# EAGLE design Adafruit FONA 800 Shield (EAGLE 6.6.0)
COMPANY: ADAFRUIT INDUSTRIES; DRAWN: KTOWN; REV: B
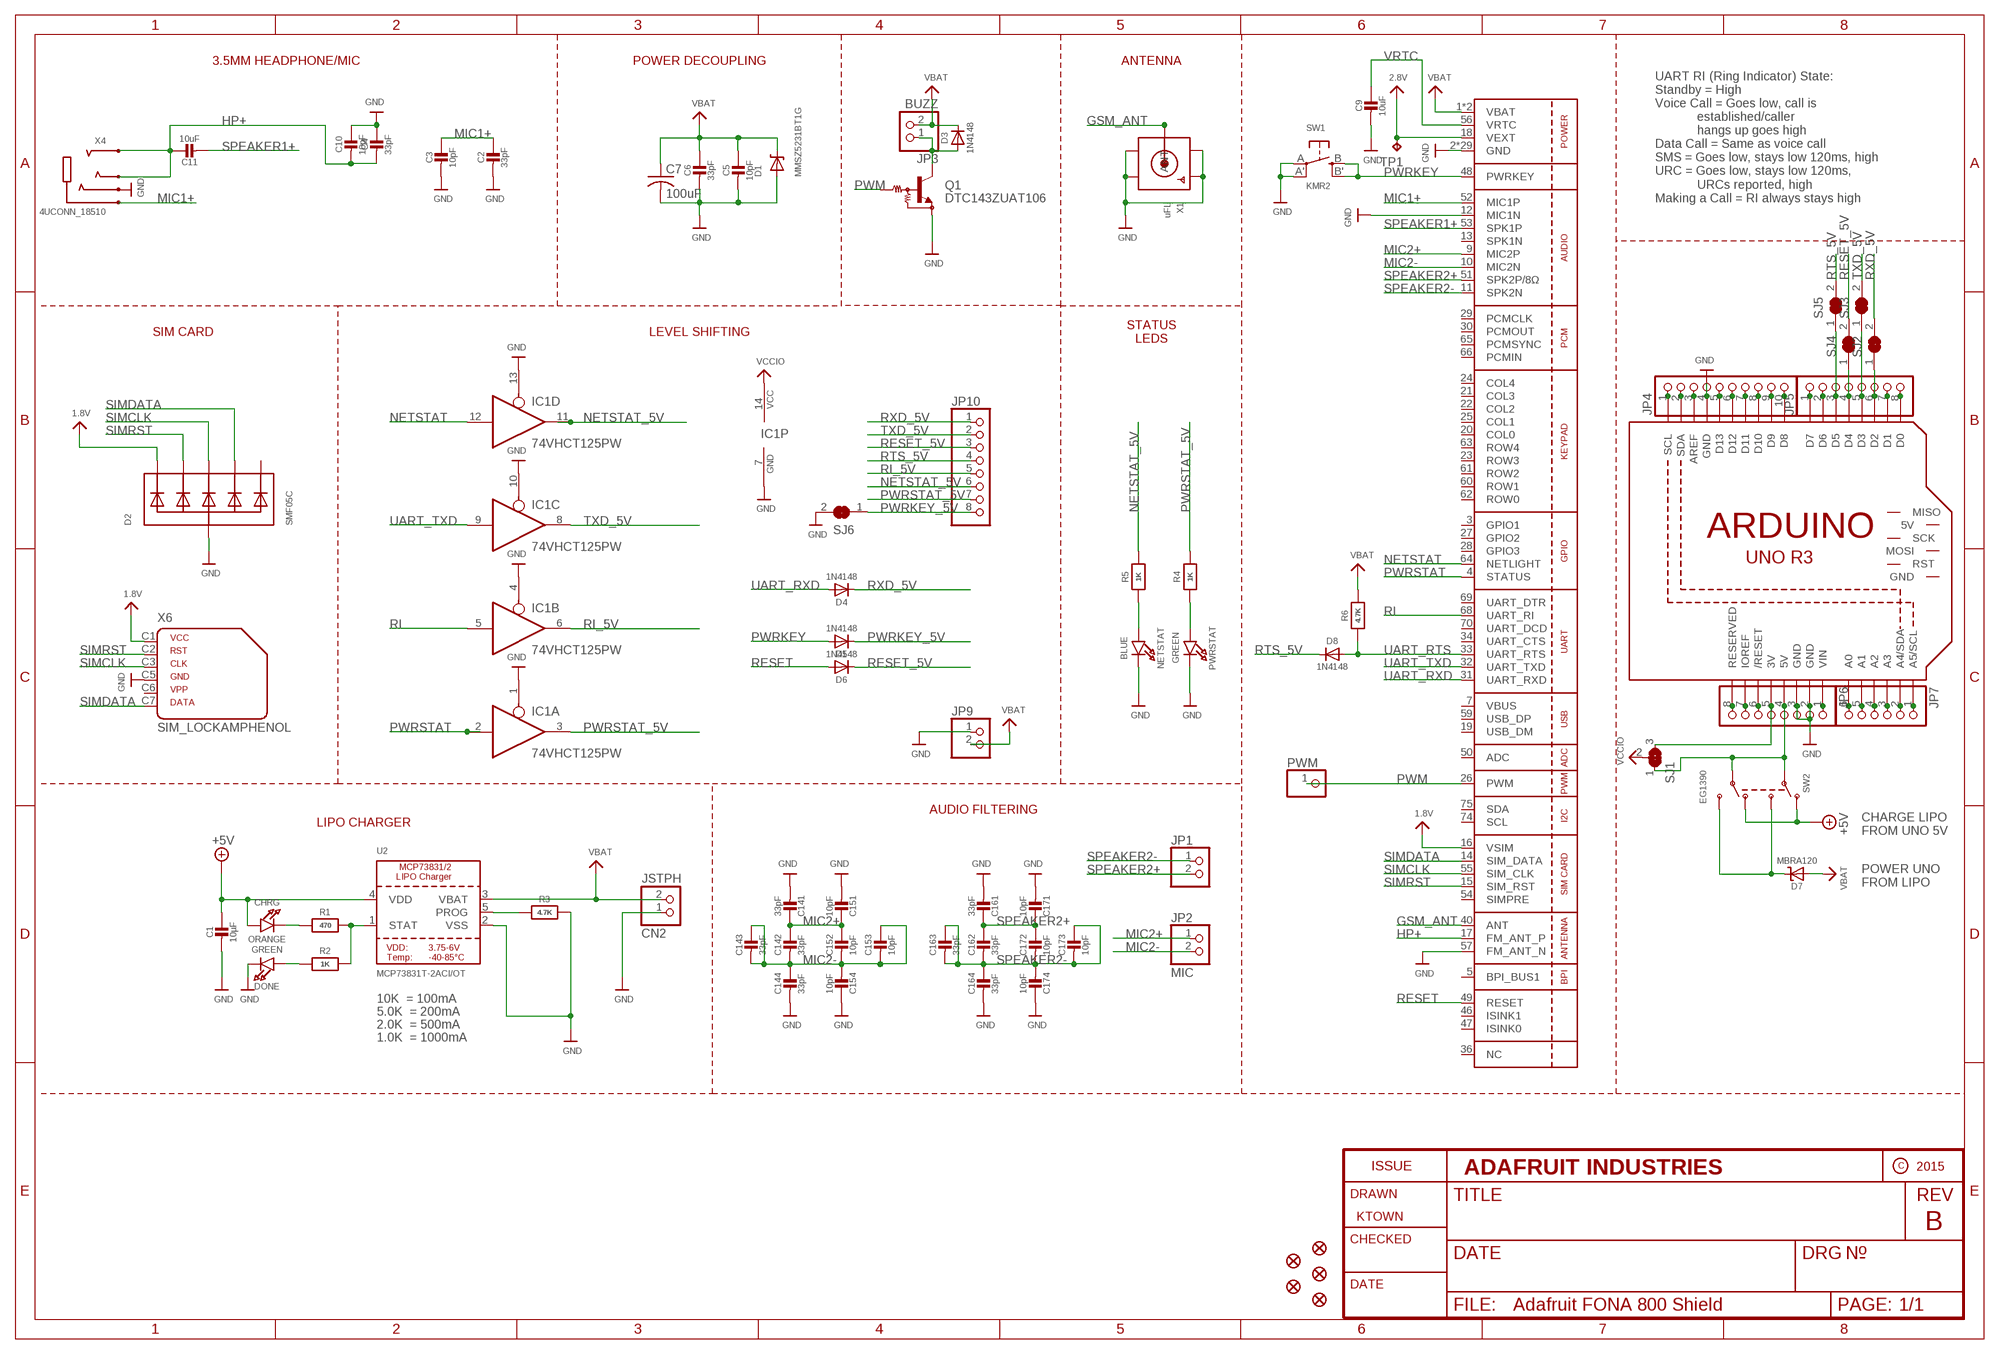
[diagram p0: schematic, sheet 1]

## Parts
C1  10µF  CAP_CERAMIC0805-NOOUTLINE  [0805-NO]
C2  33pF  CAP_CERAMIC0805-NOOUTLINE  [0805-NO]
C3  10pF  CAP_CERAMIC0805-NOOUTLINE  [0805-NO]
C4  33pF  CAP_CERAMIC0805-NOOUTLINE  [0805-NO]
C5  10pF  CAP_CERAMIC0805-NOOUTLINE  [0805-NO]
C6  33pF  CAP_CERAMIC0805-NOOUTLINE  [0805-NO]
C7  100uF  C-USC1210  [C1210]
C9  10uF  CAP_CERAMIC0805-NOOUTLINE  [0805-NO]
C10  10pF  CAP_CERAMIC0805-NOOUTLINE  [0805-NO]
C11  10uF  CAP_CERAMIC0805-NOOUTLINE  [0805-NO]
C14  33pF  CAP_4PACK1206  [RESPACK_4X0603]
C15  10pF  CAP_4PACK1206  [RESPACK_4X0603]
C16  33pF  CAP_4PACK1206  [RESPACK_4X0603]
C17  10pF  CAP_4PACK1206  [RESPACK_4X0603]
CHRG  ORANGE  LED0805_NOOUTLINE  [CHIPLED_0805_NOOUTLINE]
CN2  JSTPH  CON_JST_PH_2PIN  [JSTPH2]
D1  MMSZ5231BT1G  DIODE-ZENERSOD123  [SOD-123]
D2  SMF05C  TVSARRAY_5LANE  [SOT363]
D3  1N4148  DIODESOD-323  [SOD-323]
D4  1N4148  DIODESOD-323  [SOD-323]
D5  1N4148  DIODESOD-323  [SOD-323]
D6  1N4148  DIODESOD-323  [SOD-323]
D7  MBRA120  DIODE-SCHOTTKYSOD-123  [SOD-123]
D8  1N4148  DIODESOD-323  [SOD-323]
DONE  GREEN  LED0805_NOOUTLINE  [CHIPLED_0805_NOOUTLINE]
FID1  FIDUCIAL""  [FIDUCIAL_1MM]
FID2  FIDUCIAL""  [FIDUCIAL_1MM]
FID3  FIDUCIAL""  [FIDUCIAL_1MM]
FID4  FIDUCIAL""  [FIDUCIAL_1MM]
FID5  FIDUCIAL""  [FIDUCIAL_1MM]
IC1  74VHCT125PW  74ABT125PW  [TSSOP14]
JP1  HEADER-1X2ROUND  [1X02_ROUND]
JP2  MIC  HEADER-1X2ROUND  [1X02_ROUND]
JP3  BUZZ  HEADER-1X2ROUND  [1X02_ROUND]
JP4  HEADER-1X1070MIL  [1X10_ROUND70]
JP5  HEADER-1X876MIL  [1X08_ROUND_76]
JP6  HEADER-1X876MIL  [1X08_ROUND_76]
JP7  HEADER-1X676MIL  [1X06_ROUND_76]
JP9  HEADER-1X2ROUND  [1X02_ROUND]
JP10  HEADER-1X876MIL  [1X08_ROUND_76]
M1  ARDUINO_R3_ICSP_NODIM  [ARDUINOR3_ICSP_NODIM]
NETSTAT  BLUE  LED0805_NOOUTLINE  [CHIPLED_0805_NOOUTLINE]
PWM  PINHD-1X1CB  [1X01-CLEANBIG]
PWRSTAT  GREEN  LED0805_NOOUTLINE  [CHIPLED_0805_NOOUTLINE]
Q1  DTC143ZUAT106  MUN2211T1-NPN_DRIVER-SC59-BEC  [SC59-BEC]
R1  470  RESISTOR0805_NOOUTLINE  [0805-NO]
R2  1K  RESISTOR0805_NOOUTLINE  [0805-NO]
R3  4.7K  RESISTOR0805_NOOUTLINE  [0805-NO]
R4  1K  RESISTOR0805_NOOUTLINE  [0805-NO]
R5  1K  RESISTOR0805_NOOUTLINE  [0805-NO]
R6  4.7K  RESISTOR0805_NOOUTLINE  [0805-NO]
SJ1  SOLDERJUMPER_2WAY  [SOLDERJUMPER_2WAY_OPEN_NOPASTE]
SJ2  SOLDERJUMPER_CLOSED  [SOLDERJUMPER_CLOSEDWIRE]
SJ3  SOLDERJUMPER_CLOSED  [SOLDERJUMPER_CLOSEDWIRE]
SJ4  SOLDERJUMPER_CLOSED  [SOLDERJUMPER_CLOSEDWIRE]
SJ5  SOLDERJUMPER_CLOSED  [SOLDERJUMPER_CLOSEDWIRE]
SJ6  SOLDERJUMPER_CLOSED  [SOLDERJUMPER_CLOSEDWIRE]
SW1  KMR2  SWITCH_TACT_SMT  [EVQ-Q2]
SW2  EG1390  SWITCH_DPDTEG1390  [EG1390]
TP1  TPTP11R  [TP11R]
U1  SIM800H/L  GSM_SIM800L  [SIM800L]
U2  MCP73831T-2ACI/OT  MCP73831/2  [SOT23-5]
X1  uFL  SMACONNECTOR_EDGE_UFL  [SMA_EDGELAUNCH_UFL]
X4  4UCONN_18510  AUDIO_3.5MMJACK_4POL  [4UCONN_18510]
X6  SIM_LOCKAMPHENOL  [C707_10M006_512_2]

## Nets
1.8V: D2.1(C1) U1.16(VSIM) X6.C1
2.8V: TP1.TP U1.18(VEXT)
3V: JP6.5 M1.3V SJ1.3
5V: JP6.4 M1.5V SJ1.1 SW2.P1 SW2.P2
+5V: C1.1 CHRG.A SW2.O1 SW2.O2 U2.4(VDD)
A0: JP7.6 M1.A0
A1: JP7.5 M1.A1
A2: JP7.4 M1.A2
A3: JP7.3 M1.A3
A4: JP7.2 M1.A4(A4/SDA)
A5: JP7.1 M1.A5(A5/SCL)
AREF: JP4.3 M1.AREF
BUZZ-: D3.A JP3.1 Q1.C
D0: JP5.8 M1.D0
D1: JP5.7 M1.D1
D2: JP5.6 M1.D2 SJ2.1
D3: JP5.5 M1.D3 SJ3.1
D4: JP5.4 M1.D4 SJ4.1
D5: JP5.3 M1.D5 SJ5.1
D6: JP5.2 M1.D6
D7: JP5.1 M1.D7
D8: JP4.10 M1.D8
D9: JP4.9 M1.D9
D10: JP4.8 M1.D10
D11: JP4.7 M1.D11
D12: JP4.6 M1.D12
D13: JP4.5 M1.D13
GND: C1.2 C2.2 C3.2 C4.1 C5.2 C6.2 C7.2 C9.2 C10.1 C14.5 C14.8 C15.4 C15.8 C16.5 C16.8 C17.4 C17.8 CN2.1 D1.A D2.2(A) DONE.C IC1.1(A:OE) IC1.4(B:OE) IC1.7(P:GND) IC1.10(C:OE) IC1.13(D:OE) JP4.4 JP6.2 JP6.3 JP9.1 M1.GND M1.GND@1(GND) M1.GND@3(GND) NETSTAT.C PWRSTAT.C Q1.E R3.2 SJ6.2 SW1.A'(P1) SW1.A(P) U1.2(GND) U1.6(GND) U1.8(GND) U1.12(MIC1N) U1.35(GND) U1.37(GND) U1.38(GND) U1.39(GND) U1.41(GND) U1.43(GND) U1.44(GND) U1.45(GND) U1.57(FM_ANT_N) U1.58(GND) U1.67(GND) U1.71(GND) U1.72(GND) U1.73(GND) U1.76(GND) U1.77(GND) U1.78(GND) U1.79(GND) U1.80(GND) U1.81(GND) U1.82(GND) U1.83(GND) U1.84(GND) U1.85(GND) U1.86(GND) U1.87(GND) U1.88(GND) U2.2(VSS) X1.GND@1(GND1) X1.GND@2(GND2) X1.GND@3(GND3) X1.GND@4(GND4) X4.4-INNER_SLEEVE(RING1) X6.C5
GSM_ANT: U1.40(ANT) X1.P(ANT)
HP+: C4.2 C10.2 C11.1 U1.17(FM_ANT_P) X4.2-TIP(RING3) X4.3-OUTER_SLEEVE(RING2)
IOREF: JP6.7 M1.IOREF
MIC1+: C2.1 C3.1 U1.52(MIC1P) X4.1-GND(TIP)
MIC2+: C14.1 C14.2 C15.1 C15.2 JP2.1 U1.9(MIC2P)
MIC2-: C14.3 C14.4 C14.6 C14.7 C15.3 C15.5 C15.6 C15.7 JP2.2 U1.10(MIC2N)
N$1: CHRG.C R1.1
N$2: R1.2 R2.2 U2.1(STAT)
N$4: PWRSTAT.A R4.1
N$5: R3.1 U2.5(PROG)
N$6: DONE.A R2.1
N$7: D7.C SW2.S1 SW2.S2
N$9: NETSTAT.A R5.1
NC: JP6.8 M1.RESERVED
NETSTAT: IC1.12(D:I) U1.64(NETLIGHT)
NETSTAT_5V: IC1.11(D:O) JP10.6 R5.2
PWM: PWM.1 Q1.B U1.26(PWM)
PWRKEY: D5.A SW1.B'(S1) SW1.B(S) U1.48(PWRKEY)
PWRKEY_5V: D5.C JP10.8 SJ6.1
PWRSTAT: IC1.2(A:I) U1.4(STATUS)
PWRSTAT_5V: IC1.3(A:O) JP10.7 R4.2
RESET: D6.A U1.49(RESET)
RESET_5V: D6.C JP10.3 SJ4.2
RI: IC1.5(B:I) U1.68(UART_RI)
RI_5V: IC1.6(B:O) JP10.5
RST: JP6.6 M1.RESET(/RESET)
RTS_5V: D8.C JP10.4 SJ5.2
RXD_5V: D4.C JP10.1 SJ2.2
SCL: JP4.1 M1.SCL
SDA: JP4.2 M1.SDA
SIMCLK: D2.4(C3) U1.55(SIM_CLK) X6.C3
SIMDATA: D2.5(C4) U1.14(SIM_DATA) X6.C7
SIMRST: D2.3(C2) U1.15(SIM_RST) X6.C2
SPEAKER1+: C11.2 U1.53(SPK1P)
SPEAKER2+: C16.1 C16.2 C17.1 C17.2 JP1.2 U1.51(SPK2P/8Ω)
SPEAKER2-: C16.3 C16.4 C16.6 C16.7 C17.3 C17.5 C17.6 C17.7 JP1.1 U1.11(SPK2N)
TXD_5V: IC1.8(C:O) JP10.2 SJ3.2
UART_RTS: D8.A R6.1 U1.33(UART_RTS)
UART_RXD: D4.A U1.31(UART_RXD)
UART_TXD: IC1.9(C:I) U1.32(UART_TXD)
VBAT: C5.1 C6.1 C7.1 CN2.2 D1.C D3.C D7.A JP3.2 JP9.2 R6.2 U1.1(VBAT) U1.42(VBAT) U2.3(VBAT)
VCCIO: IC1.14(P:VCC) SJ1.2
VIN: JP6.1 M1.VIN
VRTC: C9.1 U1.56(VRTC)
Unconnected: D2.6(C5) M1.5V_ICSP(5V) M1.GND@2(GND) M1.MISO M1.MOSI M1.RESET_ICSP(RST) M1.SCK U1.3(GPIO1) U1.5(BPI_BUS1) U1.13(SPK1N) U1.19(USB_DM) U1.20(COL0) U1.21(COL3) U1.22(COL2) U1.23(ROW3) U1.24(COL4) U1.25(COL1) U1.27(GPIO2) U1.28(GPIO3) U1.29(PCMCLK) U1.30(PCMOUT) U1.34(UART_CTS) U1.36(NC) U1.46(ISINK1) U1.47(ISINK0) U1.50(ADC) U1.54(SIMPRE) U1.59(USB_DP) U1.60(ROW1) U1.61(ROW2) U1.62(ROW0) U1.63(ROW4) U1.65(PCMSYNC) U1.66(PCMIN) U1.69(UART_DTR) U1.70(UART_DCD) U1.74(SCL) U1.75(SDA) X6.C6

## Notes on the sheet
- 3.5MM HEADPHONE/MIC | POWER DECOUPLING | ANTENNA
- UART RI (Ring Indicator) State:
  Standby = High
  Voice Call = Goes low, call is 
              established/caller 
              hangs up goes high
  Data Call = Same as voice call
  SMS = Goes low, stays low 120ms, high
  URC = Goes low, stays low 120ms,
              URCs reported, high
  Making a Call = RI always stays high
- SIM CARD | LEVEL SHIFTING
- STATUS
  LEDS
- AUDIO FILTERING
- LIPO CHARGER
- CHARGE LIPO
  FROM UNO 5V
- POWER UNO
  FROM LIPO
- 10K  = 100mA
- 5.0K  = 200mA
- 2.0K  = 500mA
- 1.0K  = 1000mA

## Power pins joined to a net without a drawn wire
VBUS: U1.7(VBUS)

## Library data of the parts
C1-C6 C9-C11 = microbuilder:CAP_CERAMIC: Ceramic Capacitors For new designs, use the packages preceded by an '_' character since they are more reliable: The following footprints should be used on most boards: _0402 - Standard footprint for regular board layouts _0603 - Standard footprint for regular board layouts _0805 - Standard footprint for regular board layouts _1206 - Standard footprint for regular board layouts For extremely tight-pitch boards where space is at a premium, the following 'micro-pitch' footprints can be used (smaller pads, no silkscreen outline, etc.): _0402MP - Micro-pitch footprint for very dense/compact boards _0603MP - Micro-pitch footprint for very dense/compact boards _0805MP - Micro-pitch footprint for very dense/compact boards _1206MP - Micro-pitch footprint for very dense/compact boards
C7 = rcl:C-US: CAPACITOR, American symbol
C14-C17 = microbuilder:CAP_4PACK
CHRG DONE NETSTAT PWRSTAT = microbuilder:LED: LED 0603 - 0603 Surface Mount Package 2mA: Green LED - Low Power (3.9mcd, 2ma, 1.7Vf) - Digikey: 475-2709-2-ND Orange LED - Low Power (9.8mcd, 2ma, 1.8Vf) - Digikey: 475-1194-2-ND Red LED - Low Power (5mcd, 2ma, 1.8Vf) - Digikey: 475-1195-2-ND Yellow LED - Low Power (7mcd, 2ma, 1.8Vf) - Digikey: 475-1196-2-ND 5mA: Blue LED - Low Power (17mcd, 5ma, 2.9Vf) - Digikey: LNJ937W8CRACT-ND 0805 - 0805 Surface Mount Package 2mA: Red LED (8.8mcd, 2mA, 1.8Vf, Clear) - Low Power [Digikey: 475-2510-1-ND] Green LED (5mcd, 2mA, 1.8Vf, Clear) - Low Power [Digikey: 475-2730-1-ND] Yellow LED (11.3mcd, 2mA, 1.8Vf, Clear) - Low Power [Digikey: 475-2555-1-ND] 20mA: Red LED (104mcd, 20mA, Diffused) - LS R976 [Digikey: 475-1278-6-ND] Red LED (12mcd, 20mA, 2.0Vf, Clear) - APT2012EC [Digikey: 754-1128-1-ND] Green LED (15mcd, 20mA, 2.2Vf, Clear) - APT2012GC [Digikey: 754-1131-1-ND] Orange LED (160mcd, 20mA, 2.1Vf, Clear) - APT2012SECK [Digikey: 754-1130-1-ND] 1206 - 1206 Surface Mount Package Green LED (26mcd, 20mA, Diffused) - LG N971 [Digikey: 475-1407-6-ND] Red LED (15mcd, 20mA, Diffused) - LH N974 [Digikey: 475-1416-6-ND] Cree - Cree High-Power Surface Mount LEDs XPEBWT-L1-0000-00D50 - White 111lm 350mA 2.9Vf 6200K 110° XTEAWT-00-0000-00000LEE3 - White 114lm 350mA 2.85Vf 5000K 115° Everlight - Everlight 45-21 Series Surface Mount LEDs 45-21/QK2C-B2832AC2CB2/2T - Warm White 2000mcd 20mA 3.25Vf 3050K 120° 45-21/LK2C-B38452C4CB2/2T - Nuetral White 2000mcd 20mA 3.25Vf 4150K 120° 45-21/LK2C-B50634C6CB2/2T - Cold White 2200mcd 20mA 3.25Vf 5650K 120° PLCC2 Reverse Mount LS T77K-J1L2-1-0-2-R18-Z - Red 11.25mcd 2mA 1.8Vf 630nm 120° LO T77K-L1M2-24-Z - Orange 19.6mcd 2mA 1.8Vf 606nm 120° LY T77K-K2M1-26-Z - Yellow 15.7mcd 2mA 1.8Vf 587nm 120°
CN2 = microbuilder:CON_JST_PH_2PIN: JST 2-Pin Right-Angle Connector PH-Series - 4UConnector: 17311 SH-Series - 4UConnector: 07278
D1 = microbuilder:DIODE-ZENER: Zener Diode SMA: 30V 1W Zener Diode, 1.2Vf - Digikey: SMAZ30-FDICT-ND
D2 = microbuilder:TVSARRAY_5LANE: Voltage Transient Suppressor Array SOT363 SMF05C - 100W 5V: Digikey - SMF05CT1GOSCT-ND
D3-D6 D8 = microbuilder:DIODE: Diode SMA Model Volts Amps Type Vf Ir Digikey # Notes SSA34-E3 40V 3A Schottky 480mV @ 3A 200uA @ 40V SSA34-E3/61TGITR-ND CDBA120-G 20V 1A Schottky 500mV @ 1A 500uA @ 20V 641-1014-6-ND REEL MBRA210 10V 2A Schottky 350mV @ 2A 700uA @ 10V MBRA210LT3 SOD-123 Model Volts Amps Type Vf Ir Order # Notes BAT54T1G 30V 200mA Schottky 800mV @ 200mA 2uA @ 25V BAT54T1GOSTR-ND B0530W 30V 500mA Schottky 430mV @ 500mA 130uA @ 30V B0530W-FDICT-ND REEL MBR120 20V 1A Schottky 340mV @ 1A MBR120VLSFT1GOSCT-ND SOD-323 Model Volts Amps Type Vf Ir Order # Notes PMEG2005EJ 20V 500mA Schottky 355mV @ 500mA 568-4110-1-ND ZLLS410 10V 570mA Schottky 380mV @ 570mA ZLLS410CT-ND 1N4148WS 75V 150mA Silicon/Simple 1V 1N4148WSFSCT-ND REEL SOD-523 Model Volts Amps Type Vf Ir Order # Notes BAT54XV2 30V 200mA Schottky 0.8V @ 100mA BAT54XV2CT-ND TB751S 30V 30mA Schottky RB751S-40TE61CT-ND SOT23-R/W (R = Solder Paste/Reflow Ovens, W = Hand-Soldering) Model Volts Amps Type Vf Ir Order # Notes BAT54FILM 40V 300mA Schottky 497-7162-1-ND POWERDI-5 Model Volts Amps Type Vf Ir Order # Notes PDS560 60V 5A Schottky 670mV @ 5A 150uA @ 60V PDS560DICT-ND
D7 = microbuilder:DIODE-SCHOTTKY
FID1-FID5 = microbuilder:FIDUCIAL: Fiducial Alignment Points Various fiducial points for machine vision alignment.; BOM: EXCLUDE
IC1 = 74xx-us:74*125: Quad bus BUFFER, 3-state
JP1-JP3 JP9 = microbuilder:HEADER-1X2: PIN HEADER
JP4 = microbuilder:HEADER-1X10: PIN HEADER
JP5 JP6 JP10 = microbuilder:HEADER-1X8: PIN HEADER
JP7 = microbuilder:HEADER-1X6: PIN HEADER
M1 = adafruit:ARDUINO_R3_ICSP
PWM = adafruit:PINHD-1X1: Pin header 1x1 for 0.1" spacing With round pins
Q1 = transistor:*-NPN_DRIVER-: NPN Bias Resistor Transistor
R1-R6 = microbuilder:RESISTOR: Resistors For new designs, use the packages preceded by an '_' character since they are more reliable: The following footprints should be used on most boards: _0402 - Standard footprint for regular board layouts _0603 - Standard footprint for regular board layouts _0805 - Standard footprint for regular board layouts _1206 - Standard footprint for regular board layouts For extremely tight-pitch boards where space is at a premium, the following 'micro-pitch' footprints can be used (smaller pads, no silkscreen outline, etc.): _0402MP - Micro-pitch footprint for very dense/compact boards _0603MP - Micro-pitch footprint for very dense/compact boards _0805MP - Micro-pitch footprint for very dense/compact boards _1206MP - Micro-pitch footprint for very dense/compact boards
SJ1 = microbuilder:SOLDERJUMPER_2WAY: 2-Way Solder Jumper
SJ2-SJ6 = microbuilder:SOLDERJUMPER_CLOSED: Solder Jumper - Closed These solder jumpers are closed by default CLOSEDWIRE - 10 mil trace between pads that can be cut and resoldered later CLOSEDPERM - 63 mil trace between pads for a permanent connection (used to 'bridge' two signals, a shameless hack for Eagle). Can double as a test point as well (no cream layer)
SW1 = microbuilder:SWITCH_TACT_SMT: SMT Tact Switches 6x6mm - Digikey: P12940SCT-ND KMR2 (4.6x2.8mm) - Digikey: 401-1426-1-ND EVQ-PQHB55 - Light Touch, 160GF (4.5x4.5mm) - Digikey: P8090SCT-ND KMT0 - KMT021 NGJ LHS (etc.) IP68/Waterproof - Digikey: CKN10289CT-ND
SW2 = microbuilder:SWITCH_DPDT: Switch - DPDT A DPDT Switch acts like an SPDT switch, but has a pair of switches instead of just one. Vertical - 0.3A @ 6V SMT - Digikey: JS202011SCQN
TP1 = testpad:TP: Test pad
U1 = microbuilder:GSM_SIM800L: SIM800K Quad-Band GSM/GPRS Module 850/900/1800/1900 MHz Bluetooth EDR (3.0) FM Band: 76-109MHz (50kHz steps) -40 - 85°C
U2 = microbuilder:MCP73831/2: MCP73831/2 LIPO Charger VDD: 3.75 - 6V Temp -40 - 85°C Programmable Charge Rate: 15-500mA NOTE: STAT is a tri-state logic output on the MCP73831 and an open-drain output on the MCP73832. SOT23-5 with 4.2V output and tri-state logic on STAT = MCP73831T-2ACI/OT
X1 = microbuilder:SMACONNECTOR: SMA Connector 90° DIP SMA Connector, 50 Ohm (4UConnector: 07259)
X4 = microbuilder:AUDIO_3.5MMJACK_4POL: Footprint courtesy Morten Hjerde (Riftlabs.com) These are normally connected as follows (4-pin 3.5mm 'TRRS'), from left-to right on the schematic symbol above: Tip: Left Audio Outermost Ring: Right Audio Innermost Ring: Common/GND Shell: Mic+
X6 = microbuilder:SIM_LOCK: C707A SIMLOCK® 2.5 mm with wide solder tails Source: Data sheet <http://www.amphenol.info/downloads/C707_10M006_512_2.pdf>; OC_FARNELL: unknown; OC_NEWARK: unknown

## Board
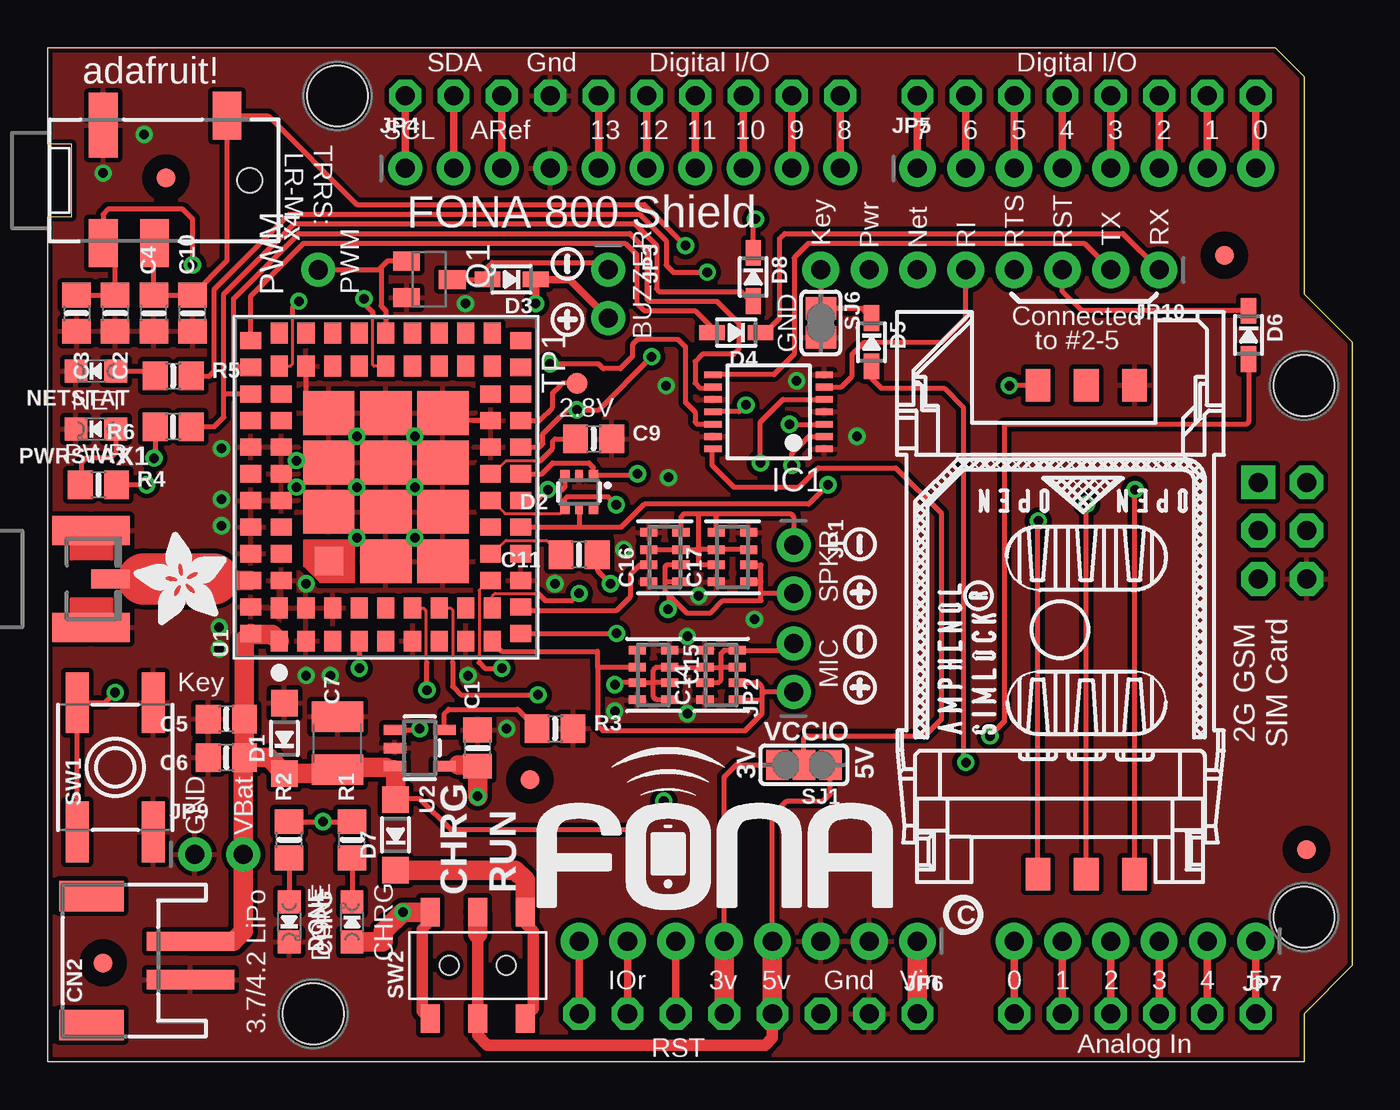
[diagram p1: board, top side]
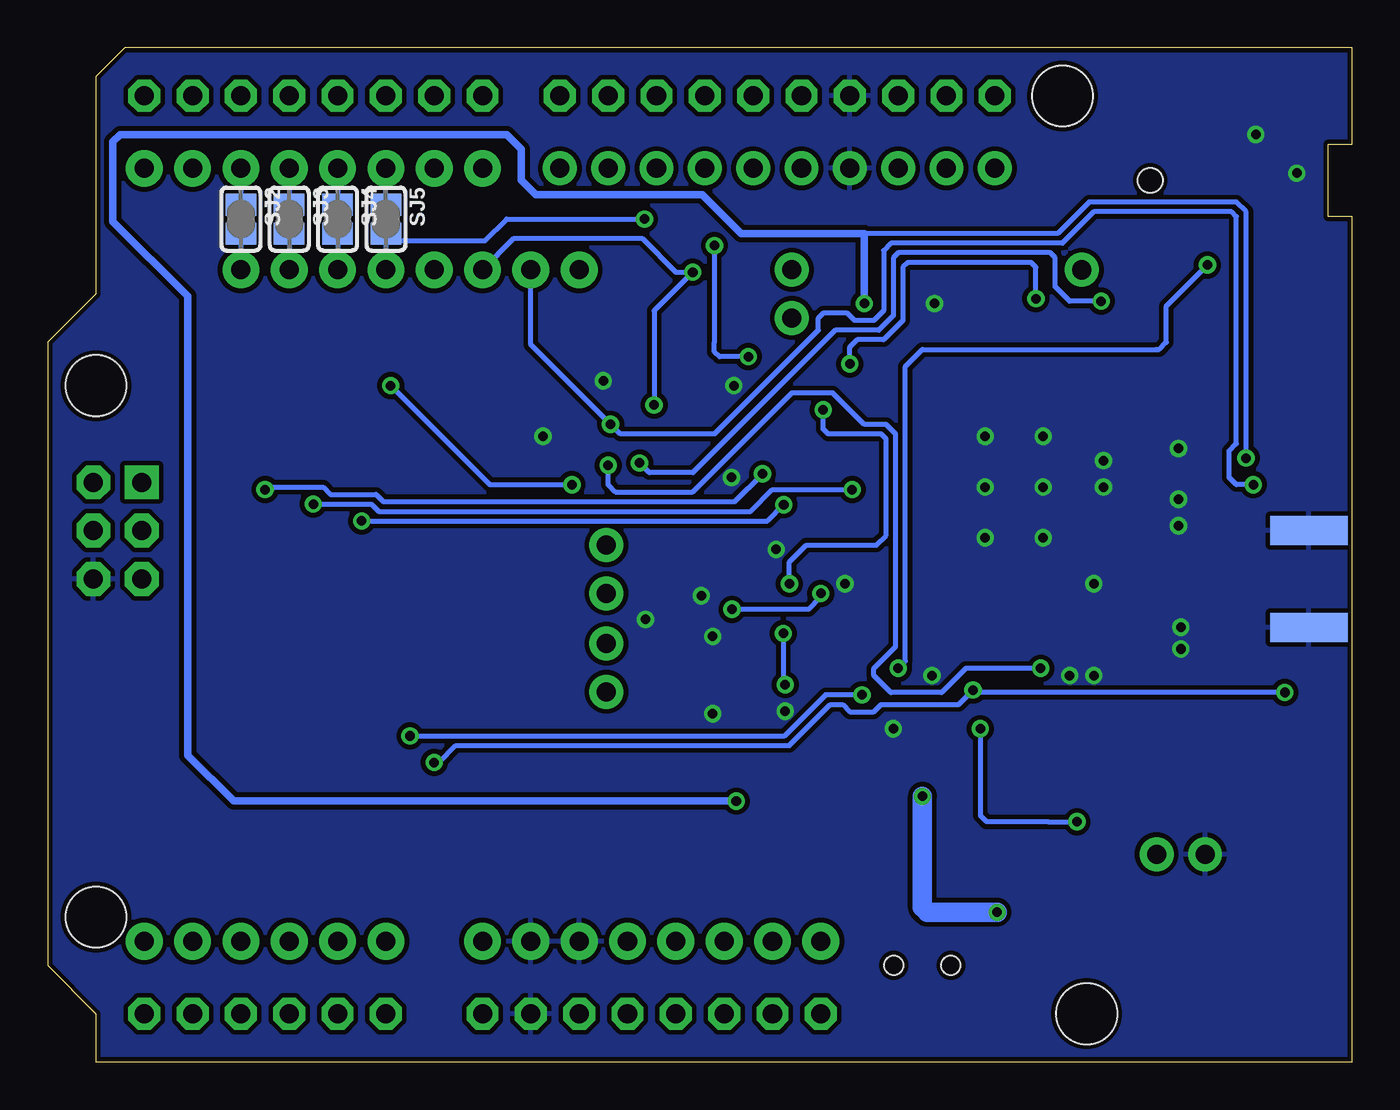
[diagram p2: board, bottom side, seen from below]

Size 68.58 x 53.34 mm. Coordinates in mm from the lower left corner, seen from the top.
Outline: 0,44.45 1.27,44.45 1.27,48.26 0,48.26 0,53.34 64.52,53.34 66.04,51.82 66.04,40.39 68.58,37.85 68.58,5.08 66.04,2.54 66.04,0 0,0 0,44.45
Copper layers (1*16): Top 0.035mm / dielectric 1.5mm / Bottom 0.035mm
Design rules "adafruit *": minimum track width 6mil, minimum drill 15.5mil, track to track 8mil, track to pad 6mil, pad to pad 8mil, via to via 8mil, smd to smd 8mil, copper to edge 10mil, drill to drill 8mil, minimum pad ring 10mil, minimum via ring 8mil, stop-mask expansion 2mil, vias tented up to drill 20mil, thermal gap 10mil
Holes 3.2 mm at 15.24,50.8 66.04,35.56 66.04,7.62 13.97,2.54

### Footprints (pad centres in the part's own frame; a part is rotated, then mirrored left to right if it is on the bottom)
0805-NO = smd 1.3 x 1.5: 1 -0.95,0; 2 0.95,0
C1210 = smd 1.6 x 2.7: 1 -1.4,0; 2 1.4,0
RESPACK_4X0603 = smd 0.45 x 0.9: 1 -1.3,-0.85; 2 -0.4,-0.85; 3 0.4,-0.85; 4 1.3,-0.85; 5 1.3,0.85; 6 0.4,0.85; 7 -0.4,0.85; 8 -1.3,0.85
CHIPLED_0805_NOOUTLINE = smd 1.2 x 1.2: A 0,-1.05; C 0,1.05
JSTPH2 = smd 1 x 4.6: 1 -1,-3.7; 2 1,-3.7 | smd 1.6 x 3.4: NC1 -3.4,1.5; NC2 3.4,1.5
SOD-123 = smd 1.4 x 1.4: A 1.85,0; C -1.85,0
SOT363 = smd 0.5 x 0.5: 1 -0.75,-0.9; 3 0.75,-0.9; 4 0.75,0.9; 6 -0.75,0.9 | smd 0.4 x 0.5: 2 0,-0.9; 5 0,0.9
SOD-323 = smd 1.35 x 0.8: A 1.27,0; C -1.27,0
FIDUCIAL_1MM = smd 1 x 1: 1 0,0
TSSOP14 = smd 0.35 x 0.9: 1 -1.95,-2.925; 2 -1.3,-2.925; 3 -0.65,-2.925; 4 0,-2.925; 5 0.65,-2.925; 6 1.3,-2.925; 7 1.95,-2.925; 8 1.95,2.925; 9 1.3,2.925; 10 0.65,2.925; 11 0,2.925; 12 -0.65,2.925; 13 -1.3,2.925; 14 -1.95,2.925
1X02_ROUND = drill 1 pad 1.778: 1 -1.27,0; 2 1.27,0
1X10_ROUND70 = drill 1 pad 1.778: 1 -11.43,0; 2 -8.89,0; 3 -6.35,0; 4 -3.81,0; 5 -1.27,0; 6 1.27,0; 7 3.81,0; 8 6.35,0; 9 8.89,0; 10 11.43,0
1X08_ROUND_76 = drill 1 pad 1.93: 1 -8.89,0; 2 -6.35,0; 3 -3.81,0; 4 -1.27,0; 5 1.27,0; 6 3.81,0; 7 6.35,0; 8 8.89,0
1X06_ROUND_76 = drill 1 pad 1.93: 1 -6.35,0; 2 -3.81,0; 3 -1.27,0; 4 1.27,0; 5 3.81,0; 6 6.35,0
ARDUINOR3_ICSP_NODIM = drill 1 pad 1.676 octagon: 3V 35.56,2.54; 5V 38.1,2.54; A0 50.8,2.54; A1 53.34,2.54; A2 55.88,2.54; A3 58.42,2.54; A4 60.96,2.54; A5 63.5,2.54; AREF 23.876,50.8; D0 63.5,50.8; D1 60.96,50.8; D2 58.42,50.8; D3 55.88,50.8; D4 53.34,50.8; D5 50.8,50.8; D6 48.26,50.8; D7 45.72,50.8; D8 41.656,50.8; D9 39.116,50.8; D10 36.576,50.8; D11 34.036,50.8; D12 31.496,50.8; D13 28.956,50.8; GND 26.416,50.8; GND@1 43.18,2.54; GND@2 40.64,2.54; IOREF 30.48,2.54; RESERVED 27.94,2.54; RESET 33.02,2.54; SCL 18.796,50.8; SDA 21.336,50.8; VIN 45.72,2.54 | drill 1 pad 1.778 octagon: 5V_ICSP 66.167,30.48; GND@3 66.167,25.4; MOSI 66.167,27.94; RESET_ICSP 63.627,25.4; SCK 63.627,27.94 | drill 1 pad 1.778 square: MISO 63.627,30.48
1X01-CLEANBIG = drill 1.016 pad 1.778: 1 0,0
SC59-BEC = smd 1 x 1.4: B -0.95,-1.2; C 0,1.2; E 0.95,-1.2
SOLDERJUMPER_2WAY_OPEN_NOPASTE = smd 1.168 x 1.6: 1 -1.397,0; 2 0,0; 3 1.397,0
SOLDERJUMPER_CLOSEDWIRE = smd 1.168 x 1.6: 1 -0.762,0; 2 0.762,0 | smd 0.635 x 0.203: WIRE 0,0
EVQ-Q2 = smd 3.2 x 1.2: A -3.4,-2; A' 3.4,-2; B -3.4,2; B' 3.4,2
EG1390 = smd 1 x 1.5: O1 -2.5,2.8; O2 -2.5,-2.8; P1 0,2.8; P2 0,-2.8; S1 2.5,2.8; S2 2.5,-2.8 | hole 1: 1.5,0; -1.5,0
TP11R = smd 1.1 x 1.1: TP 0,0
SIM800L = smd 1.1 x 0.9: 1 -8.1,5.6; 2 -8.1,4.2; 3 -8.1,2.8; 4 -8.1,1.4; 5 -8.1,0; 6 -8.1,-1.4; 7 -8.1,-2.8; 8 -8.1,-4.2; 9 -8.1,-5.6; 22 8.1,-5.6; 23 8.1,-4.2; 24 8.1,-2.8; 25 8.1,-1.4; 26 8.1,0; 27 8.1,1.4; 28 8.1,2.8; 29 8.1,4.2; 30 8.1,5.6; 43 -6.36,5.6; 44 -6.36,4.2; 45 -6.36,2.8; 46 -6.36,1.4; 47 -6.36,0; 48 -6.36,-1.4; 49 -6.36,-2.8; 50 -6.36,-4.2; 51 -6.36,-5.6; 60 6.36,-5.6; 61 6.36,-4.2; 62 6.36,-2.8; 63 6.36,-1.4; 64 6.36,0; 65 6.36,1.4; 66 6.36,2.8; 67 6.36,4.2; 68 6.36,5.6 | smd 0.9 x 1.1: 10 -7.7,-7.1; 11 -6.3,-7.1; 12 -4.9,-7.1; 13 -3.5,-7.1; 14 -2.1,-7.1; 15 -0.7,-7.1; 16 0.7,-7.1; 17 2.1,-7.1; 18 3.5,-7.1; 19 4.9,-7.1; 20 6.3,-7.1; 21 7.7,-7.1; 31 7.7,7.1; 32 6.3,7.1; 33 4.9,7.1; 34 3.5,7.1; 35 2.1,7.1; 36 0.7,7.1; 37 -0.7,7.1; 38 -2.1,7.1; 39 -3.5,7.1; 40 -4.9,7.1; 41 -6.3,7.1; 42 -7.7,7.1; 52 -4.9,-5.5; 53 -3.5,-5.5; 54 -2.1,-5.5; 55 -0.7,-5.5; 56 0.7,-5.5; 57 2.1,-5.5; 58 3.5,-5.5; 59 4.9,-5.5; 69 4.9,5.5; 70 3.5,5.5; 71 2.1,5.5; 72 0.7,5.5; 73 -0.7,5.5; 74 -2.1,5.5; 75 -3.5,5.5; 76 -4.9,5.5 | smd 1.5 x 1.5: 77 -3.9,3 | smd 2.3 x 2.7: 78 -3.9,0; 79 -3.9,-3; 80 -1.3,-3; 81 1.3,-3; 82 3.9,-3; 83 3.9,0; 84 3.9,3; 85 1.3,3; 86 -1.3,3; 87 -1.3,0; 88 1.3,0
SOT23-5 = smd 0.55 x 1.2: 1 -0.95,-1.3; 2 0,-1.3; 3 0.95,-1.3; 4 0.95,1.3; 5 -0.95,1.3
SMA_EDGELAUNCH_UFL = smd 4.064 x 1.524: GND@1 2.032,-2.54; GND@2 2.032,2.54 | smd 4.064 x 1.524 bottom: GND@3 2.032,2.54; GND@4 2.032,-2.54 | smd 2.032 x 1.016: P 3.048,0
4UCONN_18510 = smd 1.5 x 2.5: 1-GND 2.8,-3.3; 2-TIP 9.3,3.4; 3-OUTER_SLEEVE 5.5,-3.3 | smd 1.5 x 3.4: 4-INNER_SLEEVE 2.8,2.9 | hole 1.3: 10.5,0
C707_10M006_512_2 = smd 1.7 x 1.3: C1 -12.85,-3.915; C2 -12.85,-1.375; C3 -12.85,1.165; C5 12.85,-3.915; C6 12.85,-1.375; C7 12.85,1.165

### Placement (x,y rotation side)
C1  22.61,16.51 90 top
C2  3.56,39.37 270 top
C3  1.52,39.37 270 top
C4  5.59,39.37 90 top
C5  9.4,18.03 180 top
C6  9.4,16 180 top
C7  15.24,16.76 90 top
C9  28.7,32.77 0 top
C10  7.62,39.37 90 top
C11  27.94,26.67 180 top
C14  35.4,20.35 90 top
C15  31.84,20.35 270 top
C16  32.44,26.54 90 top
C17  36,26.54 90 top
CHRG  16,7.37 0 top
CN2  3.81,5.33 90 top
D1  12.45,17.02 90 top
D2  27.94,29.97 180 top
D3  24.38,41.15 180 top
D4  36.2,38.35 180 top
D5  43.31,37.85 270 top
D6  63.12,38.23 270 top
D7  18.29,11.94 90 top
D8  37.08,41.27 270 top
DONE  12.7,7.37 180 top
FID1  61.85,42.42 90 top
FID2  2.92,5.21 90 top
FID3  25.34,14.84 90 top
FID4  6.22,46.48 90 top
FID5  66.17,11.18 90 top
IC1  37.9,34.19 90 top
JP1  39.21,25.91 270 top
JP2  39.21,20.73 90 top
JP3  29.46,40.39 270 top
JP4  30.23,46.99 0 top
JP5  54.61,46.99 0 top
JP6  36.83,6.35 180 top
JP7  57.15,6.35 180 top
JP9  9.02,10.92 0 top
JP10  49.53,41.66 180 top
M1  0,0 0 top
NETSTAT  2.54,36.32 90 top
PWM  14.22,41.66 90 top
PWRSTAT  2.54,33.27 90 top
Q1  20.07,41.15 270 top
R1  16,11.68 90 top
R2  12.7,11.68 90 top
R3  26.67,17.53 0 top
R4  2.67,30.35 0 top
R5  6.6,36.07 0 top
R6  6.6,33.4 180 top
SJ1  39.75,15.62 180 top
SJ2  58.42,44.32 270 bottom
SJ3  55.88,44.32 270 bottom
SJ4  53.34,44.32 270 bottom
SJ5  50.8,44.32 270 bottom
SJ6  40.64,38.86 270 top
SW1  3.56,15.49 90 top
SW2  22.61,5.08 0 top
TP1  27.81,35.69 90 top
U1  17.78,30.23 90 top
U2  19.56,16.51 270 top
U$2  [SYMBOL_PLUS]  42.69,24.68 270 top
U$10  [ADAFRUIT_5MM]  9.4,22.99 90 top
U$26  [FONA_LOGO]  25.23,7.83 0 top
U$33  [SYMBOL_MINUS]  42.69,22.1 270 top
U$34  [SYMBOL_MINUS]  42.69,27.22 270 top
U$36  [SYMBOL_PLUS]  27.33,39.03 270 top
U$43  [SYMBOL_PLUS]  42.69,19.68 270 top
U$57  [SYMBOL_MINUS]  27.33,41.96 270 top
U$59  [PCBFEAT-REV-040]  48.13,7.75 0 top
X1  0.25,25.4 0 top
X4  0.13,46.35 0 top
X6  53.21,22.73 90 top

### Tracks (layer width: path | path; a pad name or v marks a point on that pad's centre or on a via)
1.8V  (via drill 0.5)
  Top 0.254: X6.C1 57.13,30.08 v57.15,30.1 | U1.16 25.97,30.93 26.54,31.5 28.45,31.5 28.69,31.25 D2.1 28.7,30.86 30.94,30.86 v31,30.93
  Bottom 0.254: v57.15,30.1 57.02,30.23 54.1,30.23 53.72,29.84 51.31,29.84 50.93,29.46 32.47,29.46 v31,30.93
2.8V
  Top 0.254: U1.18 25.85,33.73 26.54,34.42 26.54,35.18 26.67,35.31 27.05,35.69 TP1.TP
3V
  Top 0.254: JP6.5 35.56,14.99 36.2,15.62 SJ1.3
  Top 1.016: M1.3V JP6.5
5V
  Top 0.254: JP6.4 38.1,12.95 38.86,13.72 40.77,13.72 41.15,14.1 SJ1.1
  Top 0.61: 22.61,7.37 SW2.P2 22.61,1.4 23.11,0.89 37.72,0.89 38.1,1.27 M1.5V
  Top 1.016: M1.5V JP6.4 | SW2.P1 22.61,7.37 22.61,6.73
+5V  (via drill 0.5)
  Top 0.254: 21.27,15.56 21.53,15.56 21.59,15.62
  Top 0.406: U2.4 21.27,15.56
  Top 0.61: SW2.O2 20.07,2.28 19.68,2.67 19.68,6.99 19.94,7.24 19.94,7.71 SW2.O1
  Top 1.016: SW2.O1 v18.68,7.88 v18.67,7.87 17.65,6.86 17.65,6.35 17.62,6.32 CHRG.A | v22.61,13.97 C1.1 22.55,15.62 21.59,15.62
  Bottom 1.016: v18.67,7.87 22.35,7.87 22.61,8.13 v22.61,13.97
A0
  Top 0.406: M1.A0 JP7.6
A1
  Top 0.406: M1.A1 JP7.5
A2
  Top 0.406: M1.A2 JP7.4
A3
  Top 0.406: M1.A3 JP7.3
A4
  Top 0.406: M1.A4 JP7.2
A5
  Top 0.406: M1.A5 JP7.1
AREF
  Top 0.406: M1.AREF JP4.3
BUZZ-
  Top 0.254: Q1.C D3.A 23.11,41.78 23.37,42.04 29.08,42.04 JP3.1
D0
  Top 0.406: M1.D0 JP5.8
D1
  Top 0.406: M1.D1 JP5.7
D2
  Top 0.406: M1.D2 JP5.6
  Bottom 0.254: JP5.6 SJ2.1
D3
  Top 0.406: M1.D3 JP5.5
  Bottom 0.254: JP5.5 SJ3.1
D4
  Top 0.406: M1.D4 JP5.4
  Bottom 0.254: JP5.4 SJ4.1
D5
  Top 0.406: M1.D5 JP5.3
  Bottom 0.254: SJ5.1 JP5.3
D6
  Top 0.406: M1.D6 JP5.2
D7
  Top 0.406: M1.D7 JP5.1
D8
  Top 0.406: M1.D8 JP4.10
D9
  Top 0.406: M1.D9 JP4.9
D10
  Top 0.406: M1.D10 JP4.8
D11
  Top 0.406: M1.D11 JP4.7
D12
  Top 0.406: M1.D12 JP4.6
D13
  Top 0.406: M1.D13 JP4.5
GND  (via drill 0.5)
  Top 0.254: U1.67 13.58,34.55 13.97,34.16 14.74,34.16 U1.84 | U1.58 21.18,33.73 U1.82
  other vias: 34.22,24.51 33.62,22.38 33.62,18.32 14.86,20.32 22.1,20.32 13.59,20.32 37.16,23.27 29.81,18.44 24.13,17.53 30.29,26.95 16.26,32.89 19.3,32.89 16.26,30.23 19.3,30.23 16.26,27.56 19.3,27.56 13.08,30.23 13.08,31.62 13.59,25.15 2.92,46.74 5.08,48.77 9.14,32.26 9.14,29.59 9.14,28.19 9.02,21.72 9.02,22.86 32.51,35.56 26.67,25.15 21.97,39.88 42.55,32.89 39.37,35.81 32.64,30.73
  pour Top (isolate 0.254): 0,53.34 64.52,53.34 66.04,51.82 66.04,40.39 68.58,37.85 68.58,5.08 66.04,2.54 66.04,0 0,0
  pour Bottom (isolate 0.254): 0,53.34 64.52,53.34 66.04,51.82 66.04,40.39 68.58,37.85 68.58,5.08 66.04,2.54 66.04,0 0,0
GSM_ANT
  Top 0.254: X1.P 5.04,25.4
  Top 1.016: U1.40 8.27,25.33 8.2,25.4
  Top 2.7: 5.04,25.4 8.2,25.4 8.7,25.4
HP+  (via drill 0.5)
  Top 0.254: X4.3-OUTER_SLEEVE 5.59,43.02 C4.2 C10.2 9.43,42.13 X4.2-TIP 11.59,49.76 16.26,45.09 24.38,45.09 29.84,45.09 31.37,45.09 33.02,43.43 v33.53,42.93 | U1.17 25.85,32.33 26.04,32.51 26.04,33.02 26.92,33.91 27.3,34.29 v27.81,34.29 28.96,34.29 v31.75,37.08 | C11.1 28.89,25.85 v29.59,25.15
  Bottom 0.254: v29.59,25.15 29.59,26.29 28.7,27.18 25.02,27.18 24.51,27.69 24.51,32.77 24.77,33.02 27.56,33.02 27.81,33.27 v27.81,34.29 | v33.53,42.93 33.53,37.85 33.53,37.34 33.27,37.08 v31.75,37.08
IOREF
  Top 0.406: M1.IOREF JP6.7
MIC1+  (via drill 0.5)
  Top 0.152: U1.52 23.19,25.33 22.71,24.84 22.68,24.82 22.68,21.01
  Top 0.254: C3.1 C2.1 3.56,42.43 X4.1-GND 2.92,44.58 3.17,44.83 7.11,44.83 7.62,44.32 v7.62,41.91 | 22.68,21.01 22.99,20.7 v23.88,20.7
  Bottom 0.254: v23.88,20.7 23.5,21.08 23.5,36.58 22.61,37.47 10.29,37.47 10.16,37.47 9.78,37.85 9.78,39.75 v7.62,41.91
MIC2+
  Top 0.254: 28.92,20.73 28.92,17.68 29.18,17.43 36.67,17.43 37.56,18.32 37.56,19.08 | 37.56,19.08 37.56,19.33 | 37.56,19.33 37.56,19.71 37.32,19.95 C14.2 | C14.1 37.53,19.05 37.56,19.08 | JP2.1 37.69,19.46 37.56,19.33 | 28.92,20.73 28.94,20.75 C15.2 C15.1 | U1.9 23.38,22.09 23.88,21.59 28.9,21.59 28.9,20.75 28.92,20.73
MIC2-  (via drill 0.5)
  Top 0.254: C15.5 32,19.05 31.84,19.2 31.84,19.97 | 31.84,19.97 31.84,20.6 31.99,20.75 C15.7 C14.6 35.38,20.75 35.4,20.73 | 31.84,19.97 31.82,19.95 C15.3 29.92,19.95 v29.81,19.84 | C15.6 31.86,19.95 31.84,19.97 | C14.7 35.25,19.95 35.4,20.09 35.4,20.73 | 35.4,20.73 35.4,21.49 35.56,21.65 C14.4 38.86,21.65 JP2.2 | C14.3 35.42,20.75 35.4,20.73 | U1.10 29.61,22.53 v29.91,22.53
  Bottom 0.254: v29.91,22.53 29.91,19.94 v29.81,19.84
N$1
  Top 0.254: R1.1 CHRG.C
N$2  (via drill 0.5)
  Top 0.254: R2.2 v14.48,12.63 R1.2 | U2.1 19.49,17.46 v19.56,17.53
  Bottom 0.254: v14.48,12.63 R1.2 19.24,12.63 19.3,12.7 19.56,12.95 v19.56,17.53
N$4
  Top 0.254: PWRSTAT.A 3.59,32.04 3.3,31.75 2.03,31.75 1.78,31.5 1.78,30.41 R4.1
N$5
  Top 0.254: U2.5 20.86,18.32 21.08,18.54 24.7,18.54 R3.1
N$6
  Top 0.254: R2.1 DONE.A
N$7
  Top 0.61: SW2.S2 25.11,2.37 25.53,2.79 25.53,6.86 25.02,7.37 25.02,7.79 SW2.S1
  Top 1.016: D7.C 24.58,10.09 25.11,9.56 SW2.S1
N$9
  Top 0.254: NETSTAT.A 5.4,36.32 R5.1
N$38
  Top 0.254: 39.88,15.62 41.27,15.62
NC
  Top 0.406: M1.RESERVED JP6.8
NETSTAT  (via drill 0.5)
  Top 0.152: U1.64 17.16,36.59 17.09,36.65 17.09,39.32
  Top 0.254: 17.09,39.32 17.09,39.42 16.64,39.88 v16.64,40.13 | v26.42,36.7 28.96,36.7 29.21,36.45 30.1,36.45 30.73,37.08 30.73,37.72 30.99,37.97 33.15,37.97 33.53,37.59 33.53,34.67 34.04,34.16 34.04,33.66 34.15,33.54 IC1.12
  Bottom 0.254: v16.64,40.13 16.64,41.78 16.89,42.04 23.37,42.04 23.62,41.78 23.62,38.99 24.64,37.97 26.04,37.97 26.42,37.59 v26.42,36.7
NETSTAT_5V  (via drill 0.5)
  Top 0.254: R5.2 8.51,36.07 8.76,36.32 8.76,40.64 12.7,44.58 31.11,44.58 32.51,43.18 32.51,41.91 32.89,41.53 v34.67,41.53 | v36.7,34.54 36.35,34.19 IC1.11
  Bottom 0.254: v36.7,34.54 36.7,39.5 v34.67,41.53 35.56,41.53 37.34,43.31 44.07,43.31 JP10.6
PWM
  Top 0.254: 17.78,38.48 U1.26 17.78,39.5 17.53,39.75 17.53,41.78 | 17.53,41.78 17.78,42.04 17.84,42.1 Q1.B | PWM.1 17.4,41.66 17.53,41.78
PWRKEY  (via drill 0.5)
  Top 0.152: U1.48 19.77,23.87 19.89,23.75 19.89,21.06 19.94,21.01
  Top 0.254: SW1.B SW1.B' 3.02,18.89 v3.56,19.43 | v19.94,19.56 19.94,21.01 | 43.31,36.7 D5.A 43.31,35.94 43.81,35.43 47.12,35.43 48.13,34.42 48.13,15.88 v48.26,15.75
  Bottom 0.254: v48.26,15.75 48.01,15.75 47.12,16.64 29.59,16.64 27.43,18.8 26.8,18.8 26.42,18.41 25.15,18.41 24.77,18.8 20.7,18.8 v19.94,19.56 19.81,19.43 v3.56,19.43
PWRKEY_5V
  Top 0.254: JP10.8 SJ6.1 42.8,39.62 D5.C
PWRSTAT  (via drill 0.5)
  Top 0.254: U1.4 v16.38,20.7 | v39.12,31.37 39.12,32 40.01,32.89 IC1.2
  Bottom 0.254: v16.38,20.7 20.32,20.7 21.59,19.43 24.26,19.43 25.15,20.32 25.15,20.7 24,21.84 24,33.02 24.51,33.53 25.65,33.53 27.3,35.18 29.46,35.18 34.67,29.97 38.73,29.97 39.12,30.35 v39.12,31.37
PWRSTAT_5V  (via drill 0.5)
  Top 0.254: R4.2 v5.21,30.35 | v38.99,33.53 40.81,33.53 IC1.3
  Bottom 0.254: v5.21,30.35 6.1,30.35 6.48,30.73 6.48,32.13 6.1,32.51 6.1,44.45 6.35,44.7 13.59,44.7 15.24,43.05 24.26,43.05 24.64,42.67 24.64,39.5 25.15,38.99 26.16,38.99 26.54,39.37 27.81,39.37 28.07,39.12 28.07,38.48 33.53,33.02 38.48,33.02 v38.99,33.53 43.18,37.72 JP10.7
RESET  (via drill 0.5)
  Top 0.152: U1.49 21.19,23.87 21.29,23.77 21.29,21.03
  Top 0.254: 21.29,21.03 21.29,19.74 21.72,19.3 v25.78,19.3 | v49.53,17.14 50.29,17.91 50.29,33.53 62.99,33.53 63.12,33.66 D6.A
  Bottom 0.254: v49.53,17.14 29.84,17.14 27.69,19.3 v25.78,19.3
RESET_5V
  Top 0.254: D6.C 54.36,39.5 53.34,40.51 JP10.3
  Bottom 0.254: SJ4.2 JP10.3
RI  (via drill 0.5)
  Top 0.152: U1.68 12.76,36.59 12.88,36.7 12.88,39.37
  Top 0.254: 12.88,39.37 12.88,39.67 v13.21,40.01 | v37.47,31.5 37.47,33.66 38.65,34.84 IC1.5
  Bottom 0.254: v13.21,40.01 14.86,40.01 15.62,40.77 15.62,42.29 15.88,42.55 23.88,42.55 24.13,42.29 24.13,39.24 24.89,38.48 27.18,38.48 34.67,30.99 36.96,30.99 v37.47,31.5
RI_5V
  Top 0.254: IC1.6 41.71,35.49 42.29,36.07 42.29,37.21 42.93,37.85 46.99,37.85 48.26,39.12 JP10.5
RST
  Top 0.406: M1.RESET JP6.6
RTS_5V  (via drill 0.5)
  Top 0.254: D8.C 37.08,44.2 v37.21,44.32
  Bottom 0.254: SJ5.2 50.8,43.18 | 50.8,43.18 JP10.4 | 50.8,43.18 45.59,43.18 44.45,44.32 v37.21,44.32
RXD_5V
  Top 0.254: JP10.1 56.52,43.56 38.73,43.56 38.48,43.31 38.48,39.12 37.72,38.35 D4.C
  Bottom 0.254: SJ2.2 JP10.1
SCL
  Top 0.406: M1.SCL JP4.1
SDA
  Top 0.406: M1.SDA JP4.2
SIMCLK  (via drill 0.5)
  Top 0.152: U1.55 23.36,29.53 24.05,28.83 26.95,28.83 D2.4
  Top 0.254: X6.C3 52.05,28.43 v52.07,28.45 | D2.4 27.19,29.6 27.3,29.72 29.47,29.72 v29.89,29.3
  Bottom 0.254: v52.07,28.45 30.74,28.45 v29.89,29.3
SIMDATA  (via drill 0.5)
  Top 0.254: U1.14 27.94,28.13 | 27.94,28.13 30.16,28.13 31.37,29.34 40.01,29.34 v41.02,30.35 | D2.5 27.94,28.13 | X6.C7 52.02,35.56 v50.55,35.56
  Bottom 0.254: v50.55,35.56 45.34,30.35 v41.02,30.35
SIMRST  (via drill 0.5)
  Top 0.254: X6.C2 54.59,29.19 54.61,29.21 v54.61,29.34 | D2.3 27.19,30.24 27.05,30.1 v26.29,30.1 25.72,29.53 U1.15
  Bottom 0.254: v54.61,29.34 51.56,29.34 51.18,28.96 31.62,28.96 30.48,30.1 v26.29,30.1
SPEAKER1+
  Top 0.152: U1.53 23.4,26.73 24.08,27.41 24.11,27.43 26.23,27.43 C11.2
SPEAKER2+  (via drill 0.5)
  Top 0.152: U1.51 23.38,24.5 23.52,24.64 25.76,24.64
  Top 0.254: C16.2 32.55,26.14 32.44,26.04 32.44,25.27 | 32.44,25.27 32.44,24.77 32.67,24.54 | C16.1 32.47,25.24 32.44,25.27 | C17.2 37.49,26.14 37.49,25.27 37.46,25.24 | C17.1 37.46,25.24 | JP1.2 37.49,24.64 | 37.49,24.64 37.49,24.26 35.49,24.26 34.86,23.62 33.59,23.62 32.67,24.54 | 37.49,24.64 37.49,25.21 37.46,25.24 | 25.76,24.64 25.78,24.64 26.16,24.26 27.56,24.26 v27.94,24.64 | v32.61,23.8 32.67,23.86 32.67,24.54
  Bottom 0.254: v32.61,23.8 28.57,23.8 27.94,24.44 v27.94,24.64
SPEAKER2-
  Top 0.254: C16.4 33.29,28.66 33.46,28.83 34.22,28.83 | 34.22,28.83 35.24,28.83 | 35.24,28.83 39.06,28.83 39.21,28.68 JP1.1 | C17.5 35.15,28.74 35.24,28.83 | C17.7 34.37,26.14 34.22,26.29 34.22,27.05 | 34.22,27.05 34.22,28.83 | 34.22,27.05 34.11,26.94 C16.3 C16.6 C16.7 31.13,26.14 30.64,25.65 30.64,24.48 29.91,23.75 25.4,23.75 25.22,23.93 U1.11 | 34.22,27.05 34.33,26.94 C17.6 C17.3
TXD_5V
  Top 0.254: JP10.2 54.48,43.05 40.01,43.05 39.24,42.29 39.24,37.21 38.17,36.14 IC1.8
  Bottom 0.254: SJ3.2 JP10.2
UART_RTS
  Top 0.254: R6.1 8.76,33.4 9.27,33.91 9.27,35.05 | 9.27,35.05 9.27,40.39 12.95,44.07 30.86,44.07 32,42.93 32,40.64 32.13,40.51 36.45,40.51 36.96,40.01 D8.A | U1.33 9.35,35.13 9.27,35.05
UART_RXD
  Top 0.254: U1.31 10.68,40.27 13.46,43.05 30.35,43.05 30.99,42.42 30.99,39.88 31.37,39.5 34.04,39.5 34.92,38.61 D4.A
UART_TXD
  Top 0.254: U1.32 9.96,36.53 9.78,36.7 9.78,40.13 13.21,43.56 30.61,43.56 31.5,42.67 31.5,40.13 31.62,40.01 35.18,40.01 36.32,38.86 36.32,37.47 36.07,37.21 34.42,37.21 34.04,36.83 34.04,35.69 34.29,35.43 34.92,35.43 IC1.9
VBAT  (via drill 0.5)
  Top 0.254: R6.2 5.65,31.82 v5.59,31.75 | D7.A 18.34,13.84 19.56,13.84 21.21,12.19 30.86,12.19 v32.38,13.72
  Top 0.406: 18.29,15.11 18.29,15.53 U2.3 | JP3.2 27.43,41.15 D3.C v25.65,39.88
  Top 0.61: U2.3 17.85,15.56 17.78,15.49
  Top 1.016: CN2.2 9.76,6.33 10.29,6.86 JP9.2 10.29,15.94 C6.1 | C6.1 C5.1 10.35,22.19 U1.42 10.73,22.48 11.81,22.48 12.16,22.13 U1.1 | C6.1 11.61,16 D1.C 15.04,15.17 C7.1 15.37,15.49 17.78,15.49 | D7.A 18.29,15.11
  Bottom 0.254: v5.59,31.75 5.59,44.7 6.1,45.21 13.84,45.21 15.49,43.56 25.65,43.56
  Bottom 0.406: v25.65,39.88 25.65,43.56 32.13,43.56 34.16,45.59 42.93,45.59 43.69,46.35 43.69,48.01 44.45,48.77 64.77,48.77 65.15,48.39 65.15,44.2 61.21,40.26 61.21,16.13 58.8,13.72 v32.38,13.72
VCCIO
  Top 0.254: SJ1.2 39.75,17.02 39.88,17.14 46.1,17.14 46.99,18.03 46.99,28.83 44.58,31.24 40.51,31.24 39.5,30.23 36.07,30.23 34.92,31.37 34.92,32.19 IC1.14
VIN
  Top 1.016: M1.VIN JP6.1
VRTC
  Top 0.152: U1.56 23.41,30.93 24.08,31.6 24.11,31.62 25.85,31.62
  Top 0.254: 25.85,31.62 25.91,31.62 26.54,32.26 26.54,32.64 26.67,32.77 C9.1

### Text on the board
tPlace: adafruit! | TRRS: / LR-M | FONA 800 Shield | Key | Pwr | Net | RI | RTS | RST | TX | RX | BUZZER | PWM | GND | Connected | to #2-5 | NET | 2.8V | PWR | SPKR | MIC | 2G GSM / SIM Card | Key | VCCIO | 3V | 5V | GND | VBat | CHRG | RUN | DONE | CHRG | 3.7/4.2 LiPo